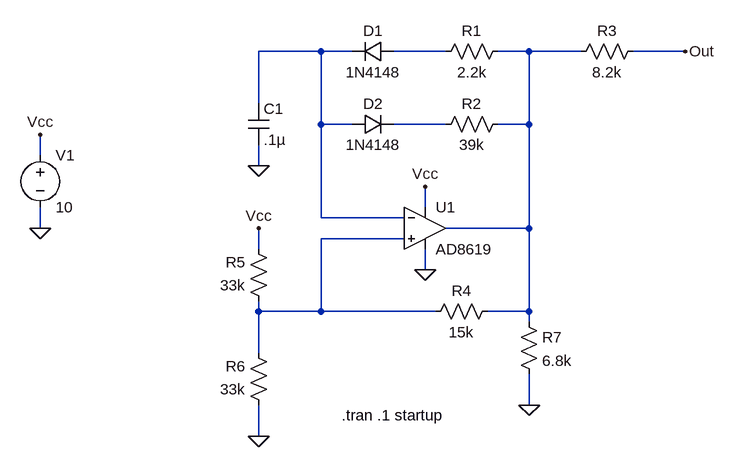
[diagram p0: schematic Oscillator1.asc]
Oscillator1.asc, the LTspice schematic file:
Version 4
SHEET 1 880 680
WIRE 48 -112 -48 -112
WIRE 96 -112 48 -112
WIRE 240 -112 160 -112
WIRE 368 -112 320 -112
WIRE 448 -112 368 -112
WIRE 608 -112 528 -112
WIRE -48 -32 -48 -112
WIRE 48 0 48 -112
WIRE 96 0 48 0
WIRE 240 0 160 0
WIRE 368 0 368 -112
WIRE 368 0 320 0
WIRE -384 48 -384 16
WIRE -48 64 -48 32
WIRE 208 128 208 96
WIRE 48 144 48 0
WIRE 176 144 48 144
WIRE -384 160 -384 128
WIRE 368 160 368 0
WIRE 368 160 240 160
WIRE 176 176 48 176
WIRE -48 192 -48 160
WIRE 208 224 208 192
WIRE -48 288 -48 272
WIRE 48 288 48 176
WIRE 48 288 -48 288
WIRE 224 288 48 288
WIRE 368 288 368 160
WIRE 368 288 304 288
WIRE 368 304 368 288
WIRE -48 352 -48 288
WIRE 368 432 368 384
WIRE -48 480 -48 432
FLAG -384 160 0
FLAG -48 480 0
FLAG -384 16 Vcc
FLAG 208 96 Vcc
FLAG 208 224 0
FLAG 368 432 0
FLAG -48 64 0
FLAG -48 160 Vcc
FLAG 608 -112 Out
SYMBOL OpAmps\\AD8619 208 96 R0
SYMATTR InstName U1
SYMBOL diode 160 -128 R90
WINDOW 0 0 32 VBottom 2
WINDOW 3 32 32 VTop 2
SYMATTR InstName D1
SYMATTR Value 1N4148
SYMBOL res 336 -128 R90
WINDOW 0 0 56 VBottom 2
WINDOW 3 32 56 VTop 2
SYMATTR InstName R1
SYMATTR Value 2.2k
SYMBOL res 336 -16 R90
WINDOW 0 0 56 VBottom 2
WINDOW 3 32 56 VTop 2
SYMATTR InstName R2
SYMATTR Value 39k
SYMBOL res 544 -128 R90
WINDOW 0 0 56 VBottom 2
WINDOW 3 32 56 VTop 2
SYMATTR InstName R3
SYMATTR Value 8.2k
SYMBOL res 320 272 R90
WINDOW 0 0 56 VBottom 2
WINDOW 3 32 56 VTop 2
SYMATTR InstName R4
SYMATTR Value 15k
SYMBOL res -32 288 R180
WINDOW 0 36 76 Left 2
WINDOW 3 36 40 Left 2
SYMATTR InstName R5
SYMATTR Value 33k
SYMBOL res -32 448 R180
WINDOW 0 36 76 Left 2
WINDOW 3 36 40 Left 2
SYMATTR InstName R6
SYMATTR Value 33k
SYMBOL voltage -384 32 R0
WINDOW 123 0 0 Left 0
WINDOW 39 0 0 Left 0
SYMATTR InstName V1
SYMATTR Value 10
SYMBOL cap -64 -32 R0
SYMATTR InstName C1
SYMATTR Value .1µ
SYMBOL diode 96 16 R270
WINDOW 0 32 32 VTop 2
WINDOW 3 0 32 VBottom 2
SYMATTR InstName D2
SYMATTR Value 1N4148
SYMBOL res 352 288 R0
SYMATTR InstName R7
SYMATTR Value 6.8k
TEXT 80 448 Left 2 !.tran .1 startup

The netlist it stands for:
* Oscillator1.asc
XU1 N005 N001 Vcc 0 N003 AD8619  ; pins In+ In- V+ V- OUT
D1 N002 N001 1N4148
R1 N003 N002 2.2k
R2 N003 N004 39k
R3 Out N003 8.2k
R4 N003 N005 15k
R5 N005 Vcc 33k
R6 0 N005 33k
V1 Vcc 0 10
C1 N001 0 .1µ
D2 N001 N004 1N4148
R7 N003 0 6.8k
.model D D
.lib standard.dio
.tran .1 startup
.backanno
.end